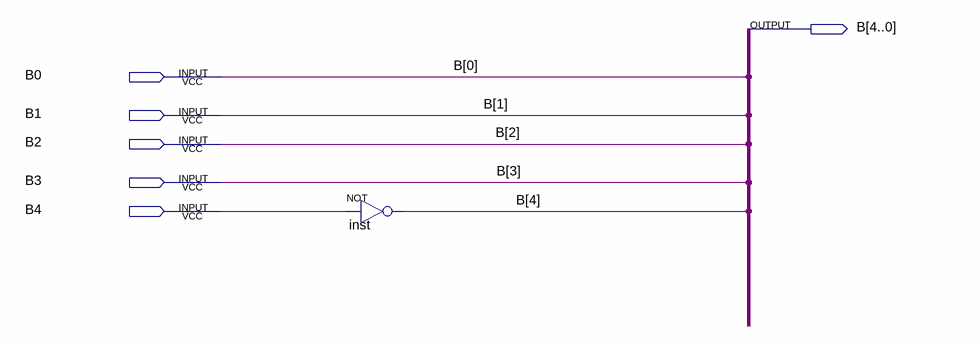
[diagram p0: schematic sheet]
// Quartus schematic InverterSinalB.bdf as structural Verilog: 1 symbols, 6 pins
module InverterSinalB (
  input  B0,
  input  B1,
  input  B2,
  input  B3,
  input  B4,
  output [4:0] B
);

  not inst (B4, B4);

  assign B = {B4, B3, B2, B1, B0};
endmodule
